# Altium project MCU021_V1.0.PrjPcb (part 3 of 3)

## Sheet MCU021_V1.0_Target_Device.SchDoc: Lauchpad Target Device, Buttons and LEDs
size A3; Date: Not shown in title block; ApprovedBy: Not shown in title block; CheckedBy: Not shown in title block; Author: Not shown in title block; CompanyName: Not shown in title block; Engineer: Not shown in title block; Organization: Not shown in title block; Address1: Not shown in title block; Address2: Not shown in title block; Address3: Not shown in title block; Address4: Not shown in title block; DocumentNumber: 4; Revision: Use project parameter SCH_Rev; SheetNumber: 4; SheetTotal: 5; PageSetup: Record=PageOptions|CenterHorizontal=True|CenterVertical=True|PrintScale=0.69|XCorrection=1.00|YCorrection=1.00|PrintKind=0|BorderSize=5000000|LeftOffset=0|BottomOffset=0|Orientation=2|PaperLength=1000|PaperWidth=1000|Scale=100|PaperSource=15|PrintQuality=600|MediaType=1|DitherType=10|PaperKind=Letter|PrintScaleMode=1; CurrentTime: Not shown in title block; CurrentDate: Not shown in title block; Time: Not shown in title block; DocumentFullPathAndName: Not shown in title block; DocumentName: Not shown in title block; ModifiedDate: Not shown in title block; ImagePath: Not shown in title block
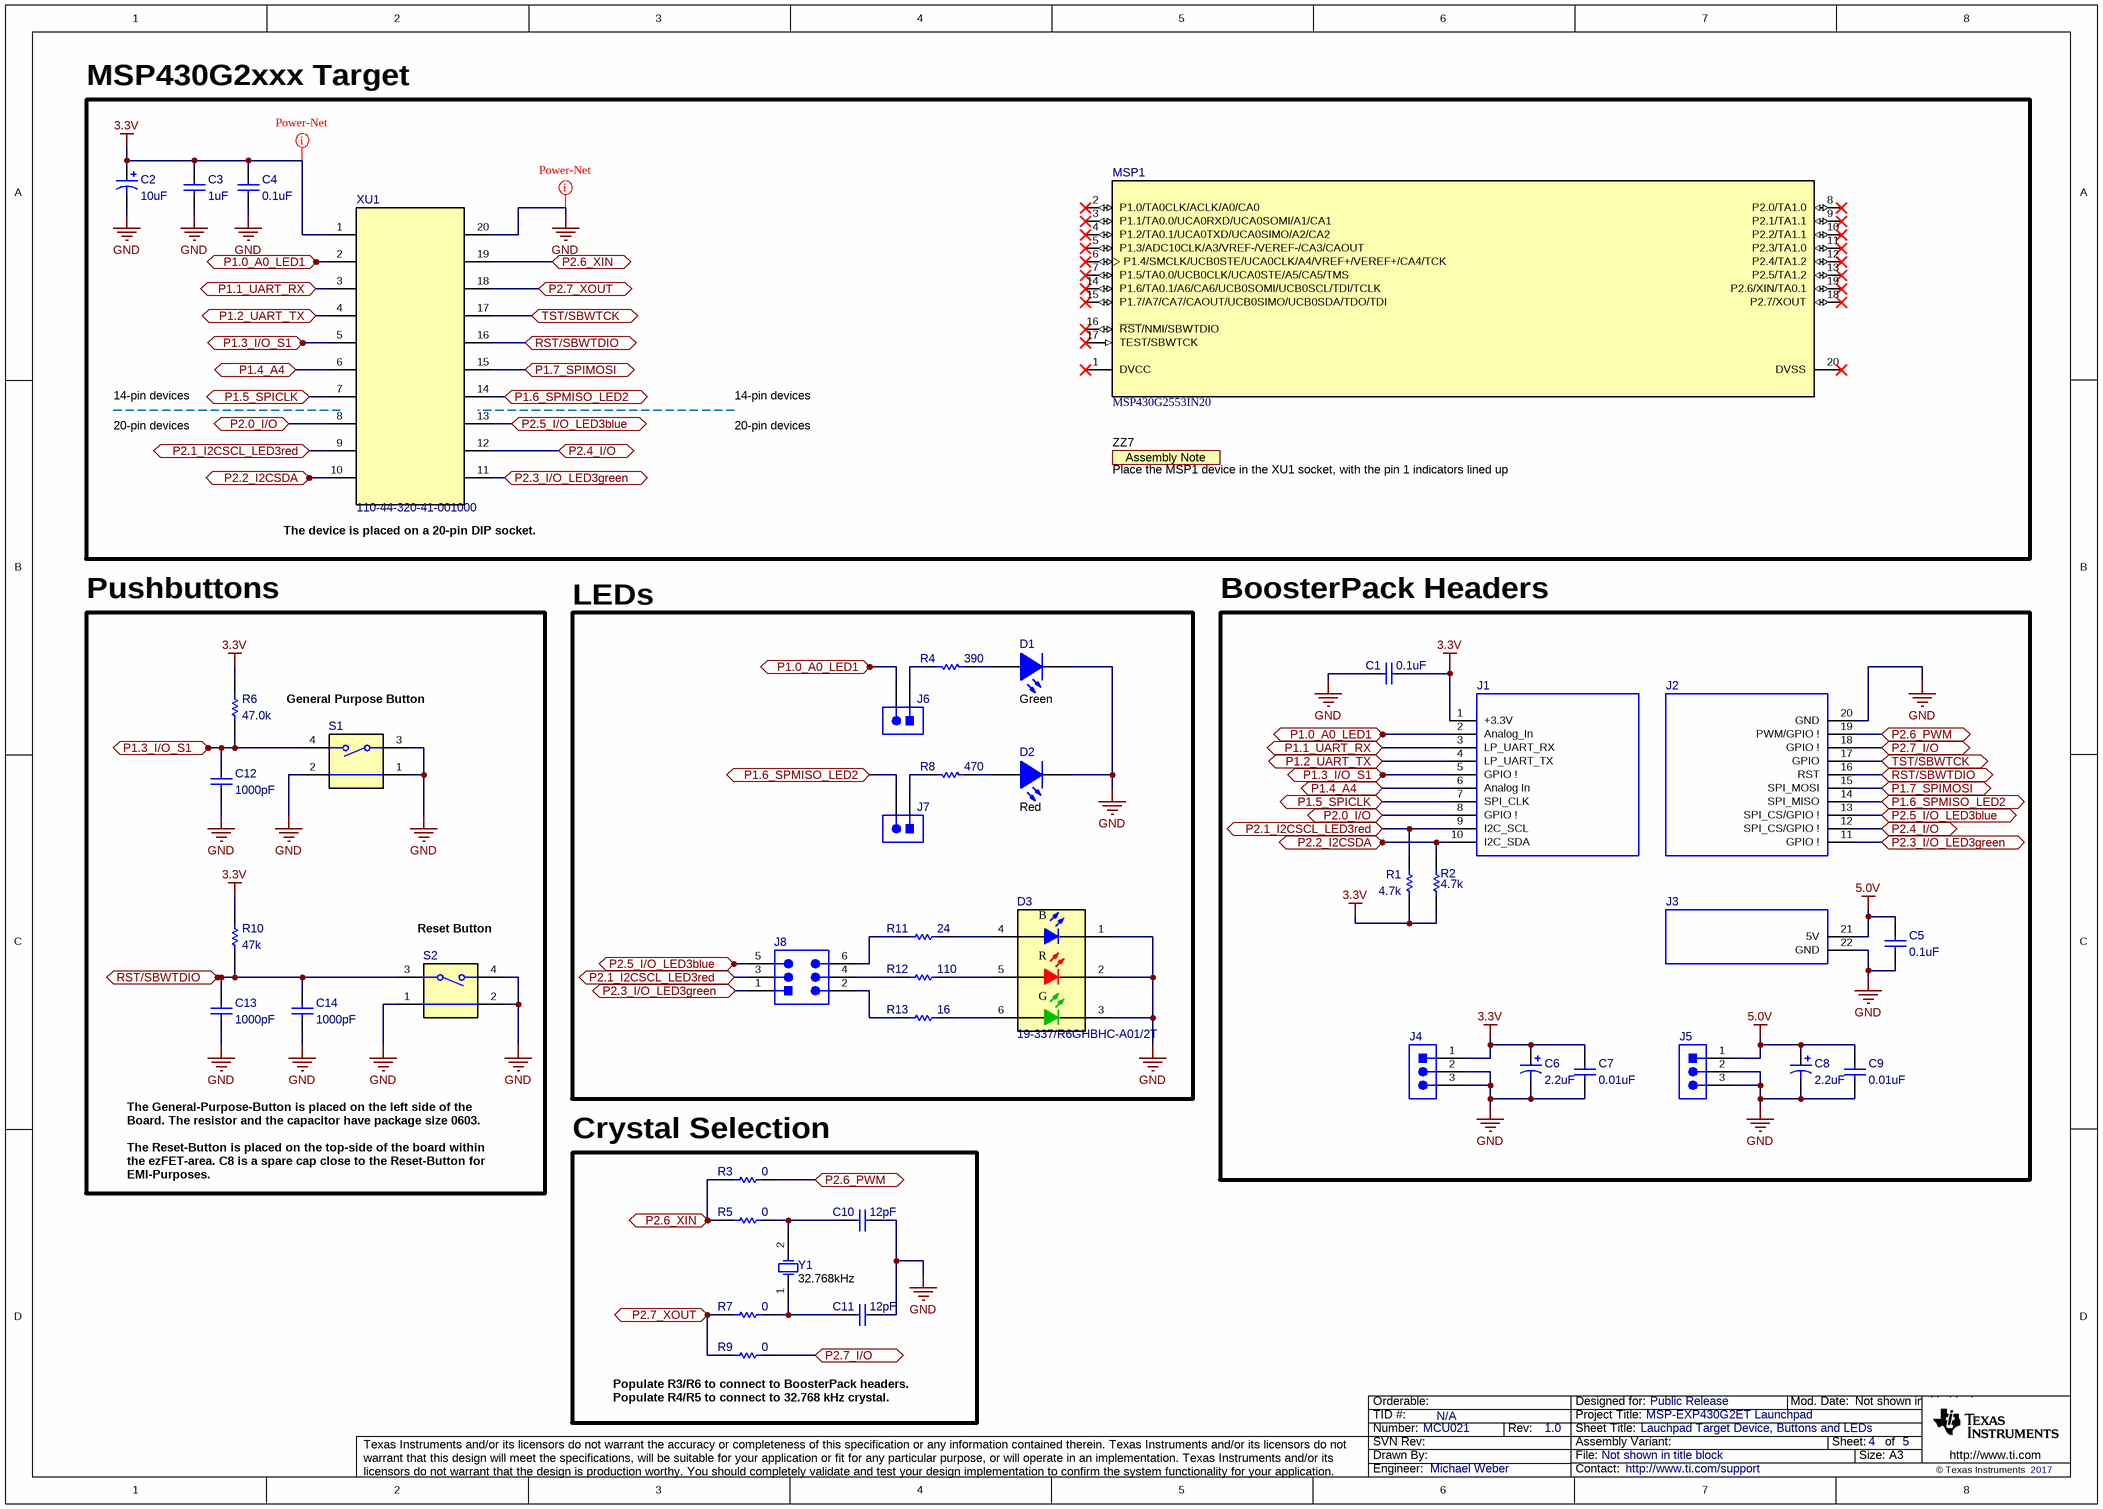
[diagram p3: MCU021_V1.0_Target_Device.SchDoc]

### Parts
C1  0.1uF  [0402]
C2  10uF  [3216-18]
C3  1uF  [0402]
C4  0.1uF  [0402]
C5  0.1uF  [0402]
C6  2.2uF  [3216-18]
C7  0.01uF  [0402]
C8  2.2uF  [3216-18]
C9  0.01uF  [0402]
C10  12pF  [0402]
C11  12pF  [0402]
C12  1000pF  [0603]
C13  1000pF  [0402]
C14  1000pF  [0402]
D1  value Green  [WL-SMCW_GREEN]  (hidden comment: 150060VS75000)
D2  value Red  [WL-SMCW_RED]  (hidden comment: 150060RS75000)
D3  19-337/R6GHBHC-A01/2T  [19-337_RGB]
J1  SSQ-110-03-F-S  [BoosterPack_20pin_J1]  (value not drawn)
J2  SSQ-110-03-F-S  [BoosterPack_20pin_J2]  (value not drawn)
J3  SSQ-102-03-F-S  [BoosterPack_20pin_J3]  (value not drawn)
J4  PEC03SAAN  [PEC03SAAN_Launchpad_3V3]  (value not drawn)
J5  PEC03SAAN  [PEC03SAAN_Launchpad_5V0]  (value not drawn)
J6  TSW-102-07-G-S  [TSW-102-07-G-S]  (value not drawn)
J7  TSW-102-07-G-S  [TSW-102-07-G-S]  (value not drawn)
J8  TSW-103-07-G-D  [TSW-103-07-G-D]  (value not drawn)
MSP1  MSP430G2553IN20  [N0020A]  (mechanical)
R1  4.7k  [0402]
R2  4.7k  [0402]
R3  0  [0603]
R4  390  [0402]
R5  0  [0603]
R6  47.0k  [0603]
R7  0  [0603]
R8  470  [0402]
R9  0  [0603]
R10  47k  [0402]
R11  24  [0402]
R12  110  [0402]
R13  16  [0402]
S1  1188E-1K2-V-TR  [SW_1188E]  (value not drawn)
S2  1188E-1K2-V-TR  [SW_1188E]  (value not drawn)
XU1  110-44-320-41-001000  [Mill-Max_110-xx-320-41-001000]
Y1  Frequency_Fixed: 32.768kHz  [ECS_ECX_31B]  (hidden comment: ECS-.327-12.5-34B-TR)
ZZ7  Place the MSP1 device in the XU1 socket, with the pin 1 indicators lined up  [AssemblyNote]  (no BOM)

### Blocks framed on the sheet
MSP430G2xxx Target: C2-C4 MSP1 XU1 ZZ7
Pushbuttons: C12-C14 R6 R10 S1 S2
LEDs: D1-D3 J6-J8 R4 R8 R11-R13
BoosterPack Headers: C1 C5-C9 J1-J5 R1 R2
Crystal Selection: C10 C11 R3 R5 R7 R9 Y1

### Ports
P1.0_A0_LED1 (bidir), P1.1_UART_RX (bidir), P1.2_UART_TX (bidir), P1.3_I/O_S1 (bidir), P1.4_A4 (bidir), P1.5_SPICLK (bidir), P1.6_SPMISO_LED2 (bidir), P1.7_SPIMOSI (bidir), P2.0_I/O (bidir), P2.1_I2CSCL_LED3red (bidir), P2.2_I2CSDA (bidir), P2.3_I/O_LED3green (bidir), P2.4_I/O (bidir), P2.5_I/O_LED3blue (bidir), P2.6_PWM (bidir), P2.6_XIN (bidir), P2.7_I/O (bidir), P2.7_XOUT (bidir), RST/SBWTDIO (bidir), TST/SBWTCK (bidir)

### Nets
3.3V: C1.1 C2.1(+) C3.1 C4.1 C6.1(+) C7.1 J1.1(+3.3V) J4.1 R1.1 R2.1 R6.2 R10.2 XU1.1
5.0V: C5.1 C8.1(+) C9.1 J3.21(5V) J5.1
GND: C1.2 C2.2(-) C3.2 C4.2 C5.2 C6.2(-) C7.2 C8.2(-) C9.2 C10.2 C11.2 C12.2 C13.2 C14.2 D1.1(K) D2.1(K) D3.1(K) D3.2(K) D3.3(K) J2.20(GND) J3.22(GND) J4.2 J4.3 J5.2 J5.3 S1.1 S1.2 S1.3 S2.1 S2.2 S2.4 XU1.20
P1.0_A0_LED1: J1.2(Analog_In) J6.2 XU1.2 ; port P1.0_A0_LED1
P1.1_UART_RX: J1.3(LP_UART_RX) XU1.3 ; port P1.1_UART_RX
P1.2_UART_TX: J1.4(LP_UART_TX) XU1.4 ; port P1.2_UART_TX
P1.3_I/O_S1: C12.1 J1.5(GPIO_!) R6.1 S1.4 XU1.5 ; port P1.3_I/O_S1
P1.4_A4: J1.6(Analog_In) XU1.6 ; port P1.4_A4
P1.5_SPICLK: J1.7(SPI_CLK) XU1.7 ; port P1.5_SPICLK
P1.6_SPMISO_LED2: J2.14(SPI_MISO) J7.2 XU1.14 ; port P1.6_SPMISO_LED2
P1.7_SPIMOSI: J2.15(SPI_MOSI) XU1.15 ; port P1.7_SPIMOSI
P2.0_I/O: J1.8(GPIO_!) XU1.8 ; port P2.0_I/O
P2.1_I2CSCL_LED3red: J1.9(I2C_SCL) J8.3 R1.2 XU1.9 ; port P2.1_I2CSCL_LED3red
P2.2_I2CSDA: J1.10(I2C_SDA) R2.2 XU1.10 ; port P2.2_I2CSDA
P2.3_I/O_LED3green: J2.11(GPIO_!) J8.1 XU1.11 ; port P2.3_I/O_LED3green
P2.4_I/O: J2.12(SPI_CS/GPIO_!) XU1.12 ; port P2.4_I/O
P2.5_I/O_LED3blue: J2.13(SPI_CS/GPIO_!) J8.5 XU1.13 ; port P2.5_I/O_LED3blue
P2.6_PWM: J2.19(PWM/GPIO_!) R3.2 ; port P2.6_PWM
P2.6_XIN: R3.1 R5.1 XU1.19 ; port P2.6_XIN
P2.7_I/O: J2.18(GPIO_!) R9.2 ; port P2.7_I/O
P2.7_XOUT: R7.1 R9.1 XU1.18 ; port P2.7_XOUT
RST/SBWTDIO: C13.1 C14.1 J2.16(RST) R10.1 S2.3 XU1.16 ; port RST/SBWTDIO
TST/SBWTCK: J2.17(GPIO) XU1.17 ; port TST/SBWTCK
NetC10_1: C10.1 R5.2 Y1.2(OSC2)
NetC11_1: C11.1 R7.2 Y1.1(OSC1)
NetD1_2: D1.2(A) R4.1
NetD2_2: D2.2(A) R8.2
NetD3_4: D3.4(A) R11.2
NetD3_5: D3.5(A) R12.2
NetD3_6: D3.6(A) R13.2
NetJ6_1: J6.1 R4.2
NetJ7_1: J7.1 R8.1
NetJ8_2: J8.2 R13.1
NetJ8_4: J8.4 R12.1
NetJ8_6: J8.6 R11.1

Not connected (* = marked no-connect by the designer): MSP1 1(DVCC)* 2(P1.0/TA0CLK/ACLK/A0/CA0)* 3(P1.1/TA0.0/UCA0RXD/UCA0SOMI/A1/CA1)* 4(P1.2/TA0.1/UCA0TXD/UCA0SIMO/A2/CA2)* 5(P1.3/ADC10CLK/A3/VREF-/VEREF-/CA3/CAOUT)* 6(P1.4/SMCLK/UCB0STE/UCA0CLK/A4/VREF+/VEREF+/CA4/TCK)* 7(P1.5/TA0.0/UCB0CLK/UCA0STE/A5/CA5/TMS)* 8(P2.0/TA1.0)* 9(P2.1/TA1.1)* 10(P2.2/TA1.1)* 11(P2.3/TA1.0)* 12(P2.4/TA1.2)* 13(P2.5/TA1.2)* 14(P1.6/TA0.1/A6/CA6/UCB0SOMI/UCB0SCL/TDI/TCLK)* 15(P1.7/A7/CA7/CAOUT/UCB0SIMO/UCB0SDA/TDO/TDI)* 16(~{RST}/NMI/SBWTDIO)* 17(TEST/SBWTCK)* 18(P2.7/XOUT)* 19(P2.6/XIN/TA0.1)* 20(DVSS)*

### Layout directives
net class Power-Net: 3.3V, GND

### Notes on the sheet
- 14-pin devices
- 20-pin devices
- (near XU1) The device is placed on a 20-pin DIP socket.
- General Purpose Button
- (near S2) Reset Button
- The General-Purpose-Button is placed on the left side of the Board. The resistor and the capacitor have package size 0603.
  The Reset-Button is placed on the top-side of the board within the ezFET-area. C8 is a spare cap close to the Reset-Button for EMI-Purposes.
- (near R9) Populate R3/R6 to connect to BoosterPack headers.
  Populate R4/R5 to connect to 32.768 kHz crystal.
- Drawn By:
- SVN Rev:
- Number:
- TID #:
- Orderable:
- Rev:
- Sheet Title:
- File:
- Project Title:
- Designed for:
- Assembly Variant:
- Mod. Date:
- Sheet:
- Size:
- of
- A3
- http://www.ti.com
- Texas Instruments and/or its licensors do not warrant the accuracy or completeness of this specification or any information contained therein. Texas Instruments and/or its licensors do not warrant that this design will meet the specifications, will be suitable for your application or fit for any particular purpose, or will operate in an implementation. Texas Instruments and/or its licensors do not warrant that the design is production worthy. You should completely validate and test your design implementation to confirm the system functionality for your application.
- Engineer:
- Contact:
- © Texas Instruments
- (in symbol 19-337/R6GHBHC-A01/2T) B; R; G
- (in symbol AssemblyNote) Assembly Note

### Library data of the parts
C1 C4 C5 = C1005X5R1A104K050BA: CAP, CERM, 0.1 µF, 10 V,+/- 10%, X5R, 0402; Manufacturer: TDK; Polarized: N; CompType: Capacitor; ValueDisplayed: 0.1µF; U/M: EA; Cap_F: 0.0000001; Tolerance_%: 10; Value1: Unknown; Value2: 10V; TaMin_C: -55; TaMax_C: 85; SizeArea_mm2: 0.5; SizeAreaWB_mm2: 3; SizeX_mm: 1; SizeZ_mm: 0.6; AEC Category: Q200; Green_Lifecycle: NRND; Green_REACh: Passed; SymbolVersion: 2008-07-09; Value: 0.1uF; PartNumber: C1005X5R1A104K050BA; PackageReference: 0402; RoHS: Y; VDC_V: 10; MountType: SMT; Technology: Ceramic; TempCo: X5R; Cap_Case: 0402; SizeY_mm: 0.5; Published: 2008-06-19; Publisher: Texas Instruments; LatestRevisionDate: 2017-05-28; ComponentLink1Description: Datasheet link; ComponentLink1URL: http://product.tdk.com/en/catalog/datasheets/mlcc_commercial_general_en.pdf; Supplier 1: Digi-Key; Supplier Part Number 1: 445-1265-1-ND; Supplier 2: Newark; Supplier Part Number 2: 90R7585; Supplier 3: Mouser; Supplier Part Number 3: 810-C1005X5R1A104K; AEC Qualified: ?; Green_EU RoHS: Passed; Green_EU RoHS-2: Passed
C2 = 293D106X0010A2TE3: CAP, TA, 10 µF, 10 V, +/- 20%, 3.4 ohm, SMD; Manufacturer: Vishay-Sprague; Polarized: Y; CompType: Capacitor; ValueDisplayed: 10µF; U/M: EA; Cap_F: 0.00001; Tolerance_%: 20; Value1: 3.4 ohm; VDC_V: 10; Value2: 10V; ESR_ohm: 3.4; IRMS_A: 0.15; TaMin_C: -55; TaMax_C: 125; Cap_Case: A; SizeAreaWB_mm2: 10.92; SizeArea_mm2: 5.12; SizeX_mm: 3.2; SizeY_mm: 1.6; SizeZ_mm: 1.8; AEC Category: Q200; SymbolVersion: 2008-07-09; Value: 10uF; PartNumber: 293D106X0010A2TE3; PackageReference: 3216-18; RoHS: Y; MountType: SMT; Technology: TA; Series: 293D; Publisher: Texas Instruments; LatestRevisionDate: 2017-03-13; LatestRevisionNote: Updated supplier links; ComponentLink1Description: Datasheet link; ComponentLink1URL: http://www.vishay.com/docs/40002/293d.pdf; Supplier 1: Digi-Key; Supplier Part Number 1: 718-1118-1-ND; Supplier 2: Newark; Supplier Part Number 2: 09K5784; Supplier 3: Mouser; Supplier Part Number 3: 74-293D106X0010A2TE3; AEC Qualified: ?
C3 = GRM155R61A105KE15D: CAP, CERM, 1 µF, 10 V,+/- 10%, X5R, 0402; Manufacturer: MuRata; Polarized: N; CompType: Capacitor; ValueDisplayed: 1µF; U/M: EA; Cap_F: 0.000001; Tolerance_%: 10; Value1: Unknown; Value2: 10V; TaMin_C: -55; TaMax_C: 85; SizeArea_mm2: 0.5; SizeAreaWB_mm2: 3; SizeX_mm: 1; SizeZ_mm: 0.6; AEC Category: Q200; Green_Lifecycle: Active; Green_REACh: Passed; SymbolVersion: 2008-07-09; Value: 1uF; PartNumber: GRM155R61A105KE15D; PackageReference: 0402; RoHS: Y; VDC_V: 10; MountType: SMT; Technology: Ceramic; TempCo: X5R; Cap_Case: 0402; SizeY_mm: 0.5; Published: 2008-06-19; Publisher: Texas Instruments; LatestRevisionDate: 2017-05-28; ComponentLink1Description: Datasheet link; ComponentLink1URL: http://search.murata.co.jp/Ceramy/PnsearchViewAction.do?HnOFG=ON&HnNFG=ON&SEL_CNT=50&sLang=en&sKey=GRM155R61A105KE15D&x=9&y=9&search=startwith; Supplier 1: Digi-Key; Supplier Part Number 1: 490-3890-1-ND; Supplier 2: Mouser; Supplier Part Number 2: 81-GRM155R61A105KE15; Supplier 3: Farnell; Supplier Part Number 3: 1735523; AEC Qualified: ?; Green_EU RoHS: Passed; Green_EU RoHS-2: Incomplete
C6 C8 = 293D225X9025A2TE3: CAP, TA, 2.2 µF, 25 V, +/- 10%, 6.3 ohm, SMD; Manufacturer: Vishay-Sprague; Polarized: Y; CompType: Capacitor; ValueDisplayed: 2.2µF; U/M: EA; Cap_F: 0.0000022; Tolerance_%: 10; Value1: 6.3 ohm; VDC_V: 25; Value2: 25V; ESR_ohm: 6.3; IRMS_A: 0.11; TaMin_C: -55; TaMax_C: 125; Cap_Case: A; SizeAreaWB_mm2: 10.92; SizeArea_mm2: 5.12; SizeX_mm: 3.2; SizeY_mm: 1.6; SizeZ_mm: 1.8; AEC Category: Q200; SymbolVersion: 2008-07-09; Value: 2.2uF; PartNumber: 293D225X9025A2TE3; PackageReference: 3216-18; RoHS: Y; MountType: SMT; Technology: TA; Series: 293D; Publisher: Texas Instruments; LatestRevisionDate: 2017-03-13; LatestRevisionNote: Updated supplier links; ComponentLink1Description: Datasheet link; ComponentLink1URL: http://www.vishay.com/docs/40002/293d.pdf; Supplier 1: Digi-Key; Supplier Part Number 1: 718-1134-1-ND; Supplier 2: Newark; Supplier Part Number 2: 09K6176; Supplier 3: Mouser; Supplier Part Number 3: 74-293D225X9025A2TE3; AEC Qualified: ?
C7 C9 = GRM155R71C103KA01D: CAP, CERM, 0.01 µF, 16 V,+/- 10%, X7R, 0402; Manufacturer: MuRata; Polarized: N; CompType: Capacitor; ValueDisplayed: 0.01µF; U/M: EA; Cap_F: 0.00000001; Tolerance_%: 10; Value1: Unknown; VDC_V: 16; Value2: 16V; TaMin_C: -55; TaMax_C: 125; SizeArea_mm2: 0.5; SizeAreaWB_mm2: 3; SizeX_mm: 1; SizeZ_mm: 0.6; AEC Category: Q200; Green_Lifecycle: Active; Green_REACh: Passed; SymbolVersion: 2008-07-09; Value: 0.01uF; PartNumber: GRM155R71C103KA01D; PackageReference: 0402; RoHS: Y; MountType: SMT; Technology: Ceramic; TempCo: X7R; Cap_Case: 0402; SizeY_mm: 0.5; Published: 2008-06-19; Publisher: Texas Instruments; LatestRevisionDate: 2017-05-28; ComponentLink1Description: Datasheet link; ComponentLink1URL: http://search.murata.co.jp/Ceramy/PnsearchViewAction.do?HnOFG=ON&HnNFG=ON&SEL_CNT=50&sLang=en&sKey=GRM155R71C103KA01D&x=9&y=9&search=startwith; Supplier 1: Digi-Key; Supplier Part Number 1: 490-1313-1-ND; Supplier 2: Newark; Supplier Part Number 2: 14T3279; Supplier 3: Mouser; Supplier Part Number 3: 81-GRM36X103K16; AEC Qualified: ?; Green_EU RoHS: Passed; Green_EU RoHS-2: Incomplete
C10 C11 = GRM1555C1H120JA01D: CAP, CERM, 12 pF, 50 V,+/- 5%, C0G/NP0, 0402; Manufacturer: MuRata; Polarized: N; CompType: Capacitor; U/M: EA; Cap_F: 0.000000000012; Tolerance_%: 5; Value1: Unknown; VDC_V: 50; Value2: 50V; TaMin_C: -55; TaMax_C: 125; SizeArea_mm2: 0.5; SizeAreaWB_mm2: 3; SizeX_mm: 1; SizeZ_mm: 0.6; AEC Category: Q200; Green_Lifecycle: Active; Green_REACh: Passed; SymbolVersion: 2008-07-09; Value: 12pF; PartNumber: GRM1555C1H120JA01D; ValueDisplayed: 12pF; PackageReference: 0402; RoHS: Y; MountType: SMT; Technology: Ceramic; TempCo: C0G/NP0; Cap_Case: 0402; SizeY_mm: 0.5; Published: 2008-06-19; Publisher: Texas Instruments; LatestRevisionDate: 2017-06-01; ComponentLink1Description: Datasheet link; ComponentLink1URL: http://search.murata.co.jp/Ceramy/PnsearchViewAction.do?HnOFG=ON&HnNFG=ON&SEL_CNT=50&sLang=en&sKey=GRM1555C1H120JA01D&x=9&y=9&search=startwith; Supplier 1: Newark; Supplier Part Number 1: 14T3292; Supplier 2: Mouser; Supplier Part Number 2: 81-GRM1555C1H120JA1D; Supplier 3: Farnell; Supplier Part Number 3: 1828875; AEC Qualified: ?; Green_EU RoHS: Passed; Green_EU RoHS-2: Incomplete
C12 = GRM188R71H102JA01D: CAP, CERM, 1000 pF, 50 V,+/- 5%, X7R, 0603; Manufacturer: MuRata; Polarized: N; CompType: Capacitor; U/M: EA; Cap_F: 0.000000001; Tolerance_%: 5; Value1: Unknown; VDC_V: 50; Value2: 50V; TaMin_C: -55; TaMax_C: 125; SizeArea_mm2: 1.28; SizeAreaWB_mm2: 4.68; SizeX_mm: 1.6; SizeY_mm: 0.8; SizeZ_mm: 1; AEC Category: Q200; SymbolVersion: 2008-07-09; Value: 1000pF; PartNumber: GRM188R71H102JA01D; ValueDisplayed: 1000pF; PackageReference: 0603; RoHS: Y; MountType: SMT; Technology: Ceramic; TempCo: X7R; Cap_Case: 0603; Published: 2008-06-19; Publisher: Texas Instruments; LatestRevisionDate: 2017-06-01; ComponentLink1Description: Datasheet link; ComponentLink1URL: http://psearch.murata.com/capacitor/product/GRM188R71H102JA01%23.pdf; Supplier 1: Digi-Key; Supplier Part Number 1: 490-9733-1-ND; Supplier 2: Mouser; Supplier Part Number 2: 81-GRM39X102J50D; AEC Qualified: N; AEC Grade: N/A
C13 C14 = GRM155R71H102KA01D: CAP, CERM, 1000 pF, 50 V,+/- 10%, X7R, 0402; Manufacturer: MuRata; Polarized: N; CompType: Capacitor; U/M: EA; Cap_F: 0.000000001; Tolerance_%: 10; Value1: Unknown; VDC_V: 50; Value2: 50V; TaMin_C: -55; TaMax_C: 125; SizeArea_mm2: 0.5; SizeAreaWB_mm2: 3; SizeX_mm: 1; SizeZ_mm: 0.6; AEC Category: Q200; Green_Lifecycle: Active; Green_REACh: Passed; SymbolVersion: 2008-07-09; Value: 1000pF; PartNumber: GRM155R71H102KA01D; ValueDisplayed: 1000pF; PackageReference: 0402; RoHS: Y; MountType: SMT; Technology: Ceramic; TempCo: X7R; Cap_Case: 0402; SizeY_mm: 0.5; Published: 2008-06-19; Publisher: Texas Instruments; LatestRevisionDate: 2017-05-28; ComponentLink1Description: Datasheet link; ComponentLink1URL: http://search.murata.co.jp/Ceramy/PnsearchViewAction.do?HnOFG=ON&HnNFG=ON&SEL_CNT=50&sLang=en&sKey=GRM155R71H102KA01D&x=9&y=9&search=startwith; Supplier 1: Digi-Key; Supplier Part Number 1: 490-1303-1-ND; Supplier 2: Newark; Supplier Part Number 2: 14T3283; Supplier 3: Mouser; Supplier Part Number 3: 81-GRM36X102K50; AEC Qualified: ?; Green_EU RoHS: Passed; Green_EU RoHS-2: Incomplete
D1 = 150060VS75000: LED, Green, SMD; Manufacturer: Wurth Elektronik; Type: AlInGaP; Vf_V: 2; Value2: 2V; Io_A: 0.02; Value1: W; U/M: EA; Green_Lifecycle: Active; Green_REACh: Passed; CompType: LED; PartNumber: 150060VS75000; SymbolVersion: 2008-11-06; MountType: SMT; RoHS: Y; PackageReference: LED_0603; Color: green; Published: 2008-07-11; Publisher: Texas Instruments; ComponentLink1URL: http://katalog.we-online.de/led/datasheet/150060VS75000.pdf; ComponentLink1Description: Datasheet link; LatestRevisionDate: 2017-05-19; Supplier 1: Digi-Key; Supplier Part Number 1: 732-4980-1-ND; Supplier 2: Newark; Supplier Part Number 2: 95W3797; Supplier 3: Farnell; Supplier Part Number 3: 2322073; Green_EU RoHS: Passed; Green_EU RoHS-2: Incomplete
D2 = 150060RS75000: LED, Red, SMD; Manufacturer: Wurth Elektronik; Type: AlInGaP; Vf_V: 2; Value2: 2V; Io_A: 0.03; Vr_V: 5; Tjmax_C: 85; Power_TotalModule: 0.072; Value1: 0.072W; Angle: 140; U/M: EA; Green_Lifecycle: Active; Green_REACh: Passed; CompType: LED; PartNumber: 150060RS75000; SymbolVersion: 2008-11-06; MountType: SMT; RoHS: Y; PackageReference: LED_0603; Color: Red; Published: 2008-07-11; Publisher: Texas Instruments; ComponentLink1URL: http://katalog.we-online.de/led/datasheet/150060RS75000.pdf; ComponentLink1Description: Datasheet link; LatestRevisionDate: 2017-05-19; Supplier 1: Digi-Key; Supplier Part Number 1: 732-4978-1-ND; Supplier 2: Newark; Supplier Part Number 2: 95W3795; Supplier 3: Mouser; Supplier Part Number 3: 710-150060RS75000; Green_EU RoHS: Passed; Green_EU RoHS-2: Incomplete
D3 = 19-337/R6GHBHC-A01/2T: LED, RGB, SMD; Manufacturer: Everlight; SymbolCreator: Altium; Vf_V: 3.8; Value2: 3.8V; Io_A: 0.025; Vr_V: 5; Ir_A: 5e-005; Tjmax_C: 85; Value1: W; Angle: 120; U/M: EA; SymbolVersion: 2017-06-23; PartNumber: 19-337/R6GHBHC-A01/2T; Value: Rgb; PackageReference: 1.6x1.6mm; RoHS: Y; CompType: LED; Type: ?; MountType: SMT; Color: RGB; Published: 2008-07-11; Publisher: Texas Instruments; ComponentLink1URL: http://www.everlight.com/file/ProductFile/19-337-R6GHBHC-A01-2T.pdf; ComponentLink1Description: Datasheet link; LatestRevisionDate: 2017-06-23; Supplier 1: Digi-Key; Supplier Part Number 1: 19-337/R6GHBHC-A01/2T-ND; Supplier 2: Mouser; Supplier Part Number 2: 638-19337R6GHBHCA01T
J1 = BoosterPack_20pin_J1: Receptacle, 2.54mm, 10x1, Gold, TH; Manufacturer: Samtec; Alternate Manufacturer: Major League Electronics; Alternate PartNumber: SSHQ-110-S-08-G-LF; SymbolCreator: a0412235; Note: Booster Pack 20 pin J1; SymbolVersion: 2015-10-21; CompType: Receptacle; PartNumber: SSQ-110-03-F-S; RoHS: Y; PackageReference: 10x1 Receptacle; MountType: TH; ComponentLink1Description: Datasheet Link; Publisher: Texas Instruments; LatestRevisionDate: 2017-05-23; Supplier 1: Farnell; Supplier Part Number 1: 2283783
J2 = BoosterPack_20pin_J2: Receptacle, 2.54mm, 10x1, Gold, TH; Manufacturer: Samtec; Alternate Manufacturer: Major League Electronics; Alternate PartNumber: SSHQ-110-S-08-G-LF; SymbolCreator: a0412235; Note: Booster Pack 20 pin J2; SymbolVersion: 2015-10-21; CompType: Receptacle; PartNumber: SSQ-110-03-F-S; RoHS: Y; PackageReference: 10x1 Receptacle; MountType: TH; ComponentLink1Description: Datasheet Link; Publisher: Texas Instruments; LatestRevisionDate: 2017-05-23; Supplier 1: Farnell; Supplier Part Number 1: 2283783
J3 = BoosterPack_20pin_J3: Receptacle, 2.54mm, 2x1, Gold, TH; Manufacturer: Samtec; SymbolCreator: a0412235; Note: Booster Pack 20 pin J3; SymbolVersion: 2015-10-21; CompType: Receptacle; PartNumber: SSQ-102-03-F-S; RoHS: Y; PackageReference: 2x1 Receptacle; MountType: TH; ComponentLink1Description: Datasheet Link; Publisher: Texas Instruments; LatestRevisionDate: 2017-05-23; Supplier 1: Farnell; Supplier Part Number 1: 2283777
J4 J5 = PEC03SAAN: Header, 100mil, 3x1, Tin, TH; Manufacturer: Sullins Connector Solutions; SymbolCreator: a0412235; Pitch_mm: 2.54; Gender: Male; Shrouded: N; Row_Count: 1; Current_A: 3; Voltage_V: 1800; Cert_UL: Y; Green_Lifecycle: Not Set; Green_REACh: Incomplete; SymbolVersion: 2017-03-03; PartNumber: PEC03SAAN; PackageReference: Header, 3 PIN, 100mil, Tin; ClassName: Header; CompType: Header; RoHS: Y; MountType: TH; ComponentLink1Description: Datasheet URL; ComponentLink1URL: http://www.sullinscorp.com/catalogs/77_PAGE108-109_.100_MALE_HDR.pdf; Orientation: Vertical; PinCount: 3; ContactFinish: Tin; Color: Black; Publisher: Texas Instruments; LatestRevisionDate: 2017-05-15; Supplier 1: Digi-Key; Supplier Part Number 1: S1012E-03-ND; Green_EU RoHS: Incomplete; Green_EU RoHS-2: Incomplete
J6 J7 = TSW-102-07-G-S: Header, 100mil, 2x1, Gold, TH; Manufacturer: Samtec; SymbolCreator: a0412235; Pitch_mm: 2.54; Gender: Male; Shrouded: N; Row_Count: 1; Current_A: 6.3; Voltage_V: 550; Cert_CSA: Y; SymbolVersion: 2013-10-31; PartNumber: TSW-102-07-G-S; PackageReference: 2x1 Header; ClassName: Header; CompType: Header; RoHS: Y; MountType: TH; ComponentLink1Description: Datasheet URL; ComponentLink1URL: http://samtec.com/ftppub/pdf/TSW_TH.PDF; Orientation: Vertical; PinCount: 2; ContactFinish: Gold; Color: Black; Cert_UL: Y; Cert_CULUS: N; Cert_VDE: N; Publisher: Texas Instruments; LatestRevisionDate: 2017-04-12; Supplier 1: Digi-Key; Supplier Part Number 1: SAM1029-02-ND
J8 = TSW-103-07-G-D: Header, 100mil, 3x2, Gold, TH; Manufacturer: Samtec; SymbolCreator: a0412235; Pitch_mm: 2.54; Gender: Male; Shrouded: N; Row_Count: 2; Current_A: 6.3; Voltage_V: 550; Cert_CSA: Y; SymbolVersion: 2013-10-14; PartNumber: TSW-103-07-G-D; PackageReference: 3x2 Header; ClassName: Header; CompType: Header; RoHS: Y; MountType: TH; ComponentLink1Description: Datasheet URL; ComponentLink1URL: http://samtec.com/ftppub/pdf/TSW_TH.PDF; Orientation: Vertical; PinCount: 6; RowSpacing_mm: 2.54; ContactFinish: Gold; Color: Black; Cert_UL: Y; Cert_CULUS: N; Cert_VDE: N; Publisher: Texas Instruments; LatestRevisionDate: 2017-04-12; Supplier 1: Digi-Key; Supplier Part Number 1: SAM1028-03-ND
MSP1 = CMP-0039636-1: 16 MHz Mixed Signal Microcontroller with 16 KB Flash, 512 B SRAM and 24 GPIOs, -40 to 85 degC, 20-pin DIP (N), Pb-Free (RoHS); Manufacturer: Texas Instruments; USCI_B (I2C & SPI): 1; Cap touch I/O: Yes; Timers - 16-bit: 2; GPIO: 24; ADC Channels: 8; SubFamily: Value Line; Frequency(MHz): 16; ADC: 10-bit SAR; SRAM(B): 512; ComponentLink3Description: Package Specification; Code_JEDEC: MS-001; ComponentLink1Description: Manufacturer URL; DatasheetVersion: SLAS735G; PartNumber: MSP430G2553IN20; ComponentLink2URL: http://www.ti.com/general/docs/lit/getliterature.tsp?genericPartNumber=MSP430G2553&fileType=pdf; ComponentLink2Description: Datasheet; Comparators: Yes; USCI_A (UART/LIN/IrDA/SPI): 1; Watchdog: Yes; PackageReference: N0020A; Eco-Plan: Pb-Free (RoHS); PackageVersion: 4040049/E; Temp Sensor: Yes; ComponentLink3URL: http://www.ti.com/litv/pdf/mpds177g; PackageDescription: 20-Pin Plastic In-Line, Body 25.40 x 6.35 mm, Pitch 2.54 mm; Brown Out Reset: Yes; Mounting Technology: Through Hole; ComponentLink1URL: http://www.ti.com/; Flash(KB): 16
R1 R2 = CRCW04024K70JNED: RES, 4.7 k, 5%, 0.063 W, 0402; Manufacturer: Vishay-Dale; CompType: Resistor; Res_ohm: 4700; Value_Code: 4k70; Tolerance_%: 5; Power_W: 0.063; Value2: 0.063W; VDC_V: 50; TempCo: 200 ppm/C; SizeArea_mm2: 0.5; SizeX_mm: 1; SizeZ_mm: 0.6; EIA_Code: E24; U/M: EA; AEC Category: Q200; SymbolVersion: 2009-05-29; Value: 4.7k; PartNumber: CRCW04024K70JNED; ValueDisplayed: 4.7k; PackageReference: 0402; RoHS: Y; Value1: 5%; MountType: SMT; Technology: Thick Film; SizeY_mm: 0.5; Published: 2008-06-26; Publisher: Texas Instruments; LatestRevisionDate: 2017-04-13; ComponentLink1Description: Datasheet link; ComponentLink1URL: http://www.vishay.com/docs/20035/dcrcwe3.pdf; Supplier 1: Digi-Key; Supplier Part Number 1: 541-4.7KJCT-ND; Supplier 2: Newark; Supplier Part Number 2: 59M6733; Supplier 3: Mouser; Supplier Part Number 3: 71-CRCW0402J-4.7K-E3; AEC Qualified: ?
R3 R5 R7 R9 = CRCW06030000Z0EA: RES, 0, 5%, 0.1 W, 0603; Manufacturer: Vishay-Dale; CompType: Resistor; Value_Code: 0000; Tolerance_%: 5; Power_W: 0.1; Value2: 0.1W; VDC_V: 75; TempCo: 200 ppm/C; SizeArea_mm2: 1.28; SizeX_mm: 1.6; SizeY_mm: 0.8; SizeZ_mm: 1; EIA_Code: E24; U/M: EA; AEC Category: Q200; Green_Lifecycle: Active; Green_REACh: Passed; SymbolVersion: 2009-05-29; Value: 0; PartNumber: CRCW06030000Z0EA; ValueDisplayed: 0; PackageReference: 0603; RoHS: Y; Res_ohm: 0; Value1: 5%; MountType: SMT; Technology: Thick Film; Published: 2008-06-26; Publisher: Texas Instruments; LatestRevisionDate: 2017-05-31; ComponentLink1Description: Datasheet link; ComponentLink1URL: http://www.vishay.com/docs/20035/dcrcwe3.pdf; Supplier 1: Digi-Key; Supplier Part Number 1: 541-0.0GCT-ND; Supplier 2: Newark; Supplier Part Number 2: 52K8014; Supplier 3: Mouser; Supplier Part Number 3: 71-CRCW0603-0-E3; AEC Qualified: ?; Green_EU RoHS: Passed with Exemption; Green_EU RoHS-2: Passed
R4 = CRCW0402390RJNED: RES, 390, 5%, 0.063 W, 0402; Manufacturer: Vishay-Dale; CompType: Resistor; Value_Code: 390R; Tolerance_%: 5; Power_W: 0.063; Value2: 0.063W; VDC_V: 50; TempCo: 200 ppm/C; SizeArea_mm2: 0.5; SizeX_mm: 1; SizeZ_mm: 0.6; EIA_Code: E24; U/M: EA; AEC Category: Q200; SymbolVersion: 2009-05-29; Value: 390; PartNumber: CRCW0402390RJNED; ValueDisplayed: 390; PackageReference: 0402; RoHS: Y; Res_ohm: 390; Value1: 5%; MountType: SMT; Technology: Thick Film; SizeY_mm: 0.5; Published: 2008-06-26; Publisher: Texas Instruments; LatestRevisionDate: 2017-04-13; ComponentLink1Description: Datasheet link; ComponentLink1URL: http://www.vishay.com/docs/20035/dcrcwe3.pdf; Supplier 1: Digi-Key; Supplier Part Number 1: 541-390JCT-ND; Supplier 2: Newark; Supplier Part Number 2: 59M6731; Supplier 3: Mouser; Supplier Part Number 3: 71-CRCW0402J-390-E3; AEC Qualified: ?
R6 = CRCW060347K0FKEA: RES, 47.0 k, 1%, 0.1 W, AEC-Q200 Grade 0, 0603; Manufacturer: Vishay-Dale; CompType: Resistor; Res_ohm: 47000; Value_Code: 47k0; Tolerance_%: 1; Power_W: 0.1; Value2: 0.1W; VDC_V: 75; TempCo: 100 ppm/C; SizeArea_mm2: 1.28; SizeX_mm: 1.6; SizeY_mm: 0.8; U/M: EA; AEC Category: Q200; AEC Qualified: Y; AEC Grade: 0; SymbolVersion: 2009-05-29; Value: 47.0k; PartNumber: CRCW060347K0FKEA; ValueDisplayed: 47.0k; PackageReference: 0603; RoHS: Y; Value1: 1%; MountType: SMT; Technology: Thick Film; SizeZ_mm: 1; Published: 2008-06-26; Publisher: Texas Instruments; LatestRevisionDate: 2017-05-31; ComponentLink1Description: Datasheet link; ComponentLink1URL: http://www.vishay.com/docs/20035/dcrcwe3.pdf; Supplier 1: Digi-Key; Supplier Part Number 1: 541-47.0KHCT-ND; Supplier 2: Newark; Supplier Part Number 2: 61M5392; Supplier 3: Mouser; Supplier Part Number 3: 71-CRCW0603-47K-E3
R8 = CRCW0402470RJNED: RES, 470, 5%, 0.063 W, 0402; Manufacturer: Vishay-Dale; CompType: Resistor; Value_Code: 470R; Tolerance_%: 5; Power_W: 0.063; Value2: 0.063W; VDC_V: 50; TempCo: 200 ppm/C; SizeArea_mm2: 0.5; SizeX_mm: 1; SizeZ_mm: 0.6; EIA_Code: E24; U/M: EA; AEC Category: Q200; SymbolVersion: 2009-05-29; Value: 470; PartNumber: CRCW0402470RJNED; ValueDisplayed: 470; PackageReference: 0402; RoHS: Y; Res_ohm: 470; Value1: 5%; MountType: SMT; Technology: Thick Film; SizeY_mm: 0.5; Published: 2008-06-26; Publisher: Texas Instruments; LatestRevisionDate: 2017-04-13; ComponentLink1Description: Datasheet link; ComponentLink1URL: http://www.vishay.com/docs/20035/dcrcwe3.pdf; Supplier 1: Digi-Key; Supplier Part Number 1: 541-470JCT-ND; Supplier 2: Newark; Supplier Part Number 2: 59M6737; Supplier 3: Mouser; Supplier Part Number 3: 71-CRCW0402J-470-E3; AEC Qualified: ?
R10 = CRCW040247K0JNED: RES, 47 k, 5%, 0.063 W, 0402; Manufacturer: Vishay-Dale; CompType: Resistor; Res_ohm: 47000; Value_Code: 47k0; Tolerance_%: 5; Power_W: 0.063; Value2: 0.063W; VDC_V: 50; TempCo: 200 ppm/C; SizeArea_mm2: 0.5; SizeX_mm: 1; SizeZ_mm: 0.6; EIA_Code: E24; U/M: EA; AEC Category: Q200; SymbolVersion: 2009-05-29; Value: 47k; PartNumber: CRCW040247K0JNED; ValueDisplayed: 47k; PackageReference: 0402; RoHS: Y; Value1: 5%; MountType: SMT; Technology: Thick Film; SizeY_mm: 0.5; Published: 2008-06-26; Publisher: Texas Instruments; LatestRevisionDate: 2017-04-13; ComponentLink1Description: Datasheet link; ComponentLink1URL: http://www.vishay.com/docs/20035/dcrcwe3.pdf; Supplier 1: Digi-Key; Supplier Part Number 1: 541-47KJCT-ND; Supplier 2: Newark; Supplier Part Number 2: 52K7099; Supplier 3: Mouser; Supplier Part Number 3: 71-CRCW0402-J-47K-E3; AEC Qualified: ?
R11 = CRCW040224R0JNED: RES, 24, 5%, 0.063 W, 0402; Manufacturer: Vishay-Dale; CompType: Resistor; Value_Code: 24R0; Tolerance_%: 5; Power_W: 0.063; Value2: 0.063W; VDC_V: 50; TempCo: 200 ppm/C; SizeArea_mm2: 0.5; SizeX_mm: 1; SizeZ_mm: 0.6; EIA_Code: E24; U/M: EA; AEC Category: Q200; Green_Lifecycle: Active; Green_REACh: Passed; SymbolVersion: 2009-05-29; Value: 24; PartNumber: CRCW040224R0JNED; ValueDisplayed: 24; PackageReference: 0402; RoHS: Y; Res_ohm: 24; Value1: 5%; MountType: SMT; Technology: Thick Film; SizeY_mm: 0.5; Published: 2008-06-26; Publisher: Texas Instruments; LatestRevisionDate: 2017-06-12; ComponentLink1Description: Datasheet link; ComponentLink1URL: http://www.vishay.com/docs/20035/dcrcwe3.pdf; Supplier 1: Digi-Key; Supplier Part Number 1: 541-24JCT-ND; Supplier 2: Newark; Supplier Part Number 2: 89M6631; Supplier 3: Mouser; Supplier Part Number 3: 71-CRCW0402J-24-E3; AEC Qualified: ?; Green_EU RoHS: Passed with Exemption; Green_EU RoHS-2: Passed
R12 = CRCW0402110RFKED: RES, 110, 1%, 0.063 W, 0402; Manufacturer: Vishay-Dale; CompType: Resistor; Value_Code: 110R; Tolerance_%: 1; Power_W: 0.063; Value2: 0.063W; VDC_V: 50; TempCo: 100 ppm/C; SizeArea_mm2: 0.5; SizeZ_mm: 0.6; EIA_Code: E96; U/M: EA; AEC Category: Q200; Green_Lifecycle: Active; Green_REACh: Passed; SymbolVersion: 2009-05-29; Value: 110; PartNumber: CRCW0402110RFKED; ValueDisplayed: 110; PackageReference: 0402; RoHS: Y; Res_ohm: 110; Value1: 1%; MountType: SMT; Technology: Thick Film; SizeX_mm: 1; SizeY_mm: 0.5; Published: 2008-06-26; Publisher: Texas Instruments; LatestRevisionDate: 2017-06-12; ComponentLink1Description: Datasheet link; ComponentLink1URL: http://www.vishay.com/docs/20035/dcrcwe3.pdf; Supplier 1: Digi-Key; Supplier Part Number 1: 541-110LCT-ND; Supplier 2: Newark; Supplier Part Number 2: 52K6634; Supplier 3: Mouser; Supplier Part Number 3: 71-CRCW0402-110-E3; AEC Qualified: ?; Green_EU RoHS: Passed with Exemption; Green_EU RoHS-2: Passed
R13 = CRCW040216R0JNED: RES, 16, 5%, 0.063 W, 0402; Manufacturer: Vishay-Dale; CompType: Resistor; Value_Code: 16R0; Tolerance_%: 5; Power_W: 0.063; Value2: 0.063W; VDC_V: 50; TempCo: 200 ppm/C; SizeArea_mm2: 0.5; SizeX_mm: 1; SizeZ_mm: 0.6; EIA_Code: E24; U/M: EA; AEC Category: Q200; SymbolVersion: 2009-05-29; Value: 16; PartNumber: CRCW040216R0JNED; ValueDisplayed: 16; PackageReference: 0402; RoHS: Y; Res_ohm: 16; Value1: 5%; MountType: SMT; Technology: Thick Film; SizeY_mm: 0.5; Published: 2008-06-26; Publisher: Texas Instruments; LatestRevisionDate: 2017-06-12; ComponentLink1Description: Datasheet link; ComponentLink1URL: http://www.vishay.com/docs/20035/dcrcwe3.pdf; Supplier 1: Digi-Key; Supplier Part Number 1: 541-16JCT-ND; Supplier 2: Mouser; Supplier Part Number 2: 71-CRCW0402J-16-E3; AEC Qualified: ?
S1 S2 = 1188E-1K2-V-TR: Switch, SPST, 0.05 A, 12 VDC, SMD; Manufacturer: Diptronics; SymbolCreator: Altium; SizeAreaWB_mm2: 53.9; SizeArea_mm2: 27.3; SizeX_mm: 7.8; SizeY_mm: 3.5; VDC_V: 12; PositionCount: 1; CurrentRating_mA: 50; SymbolVersion: 2017-02-06; PartNumber: 1188E-1K2-V-TR; MountType: SMT; SizeZ_mm: 3.5; ComponentLink1Description: Datasheet URL; ComponentLink1URL: http://www.dip.com.tw/en/en-product-information/en-switch004/item/download/1976_b080c057386714e3a6604cbe658b9df3; RoHS: Y; Circuit: SPST; Orientation: Side Actuated; CompType: Switch; PackageReference: 7.8x3.5mm; Publisher: Texas Instruments; LatestRevisionDate: 2017-05-08
XU1 = 110-44-320-41-001000: Socket, DIP-20, Sleeve Pin, 2.54 mm Pitch; Manufacturer: Mill-Max; SymbolCreator: a0799628; U/M: EA; SymbolVersion: 2016-3-1; PartNumber: 110-44-320-41-001000; CompType: Socket; PackageReference: DIP-20, Body 25.3x10.1mm, Pitch 2.54mm; MountType: TH; RoHS: Y; ComponentLink1Description: Datasheet Link; ComponentLink1URL: http://www.mill-max.com/assets/pdfs/metric/090M.pdf; Publisher: Texas Instruments; LatestRevisionDate: 2017-05-30; Supplier 1: Digi-Key; Supplier Part Number 1: ED90052-ND; Supplier 2: Mouser; Supplier Part Number 2: 575-11044320; Supplier 3: Farnell; Supplier Part Number 3: 1228482
Y1 = CMP-0078856-1: Crystal, 32.768 KHz, 20 ppm, SMD; Manufacturer: ECS Inc.; SizeAreaWB_mm2: 10.5; SizeArea_mm2: 4.8; Frequency Tolerance: 20 ppm; AEC Category: Q200; TaMax_C: 85°C; SizeZ_mm: 0.9; TaMin_C: -40°C; SizeY_mm: 1.5; SizeX_mm: 3.2; ComponentLink1Description: Datasheet Link; REACh: Y; RoHS: Y; Supplier 1: Digi-Key; AEC Qualified: ?; PackageReference: 3.2x1.5mm; PartNumber: ECS-.327-12.5-34B-TR; Supplier Part Number 2: 520-327-12.5-34B; Supplier 2: Mouser; ComponentLink1URL: http://www.ecsxtal.com/store/pdf/ecx-31b.pdf; CompType: Crystal; Supplier Part Number 1: XC1617CT-ND; MountType: SMT
ZZ7 = AssemblyNote: SymbolCreator: codlsc; SymbolVersion: 2010-05-18; CompType: AssemblyNote; ClassName: AssemblyNote; Publisher: Texas Instruments; LatestRevisionDate: 2012-06-14; LatestRevisionNote: Initial Version; Alternate Manufacturer: -; Alternate PartNumber: -

## Sheet MCU021_V1.0_Hardware.SchDoc: Labels, Mechanical Hardware, Shunts, Misc.
size A3; Date: Not shown in title block; ApprovedBy: Not shown in title block; CheckedBy: Not shown in title block; Author: Not shown in title block; CompanyName: Not shown in title block; Engineer: Not shown in title block; Organization: Not shown in title block; Address1: Not shown in title block; Address2: Not shown in title block; Address3: Not shown in title block; Address4: Not shown in title block; DocumentNumber: 5; Revision: Use project parameter SCH_Rev; SheetNumber: 5; SheetTotal: 5; PageSetup: Record=PageOptions|CenterHorizontal=True|CenterVertical=True|PrintScale=1.00|XCorrection=1.00|YCorrection=1.00|PrintKind=0|BorderSize=5000000|LeftOffset=0|BottomOffset=0|Orientation=2|PaperLength=1000|PaperWidth=1000|Scale=100|PaperSource=15|PrintQuality=600|MediaType=1|DitherType=10|PaperKind=Letter|PrintScaleMode=1; CurrentTime: Not shown in title block; CurrentDate: Not shown in title block; Time: Not shown in title block; DocumentFullPathAndName: Not shown in title block; DocumentName: Not shown in title block; ModifiedDate: Not shown in title block; ImagePath: Not shown in title block
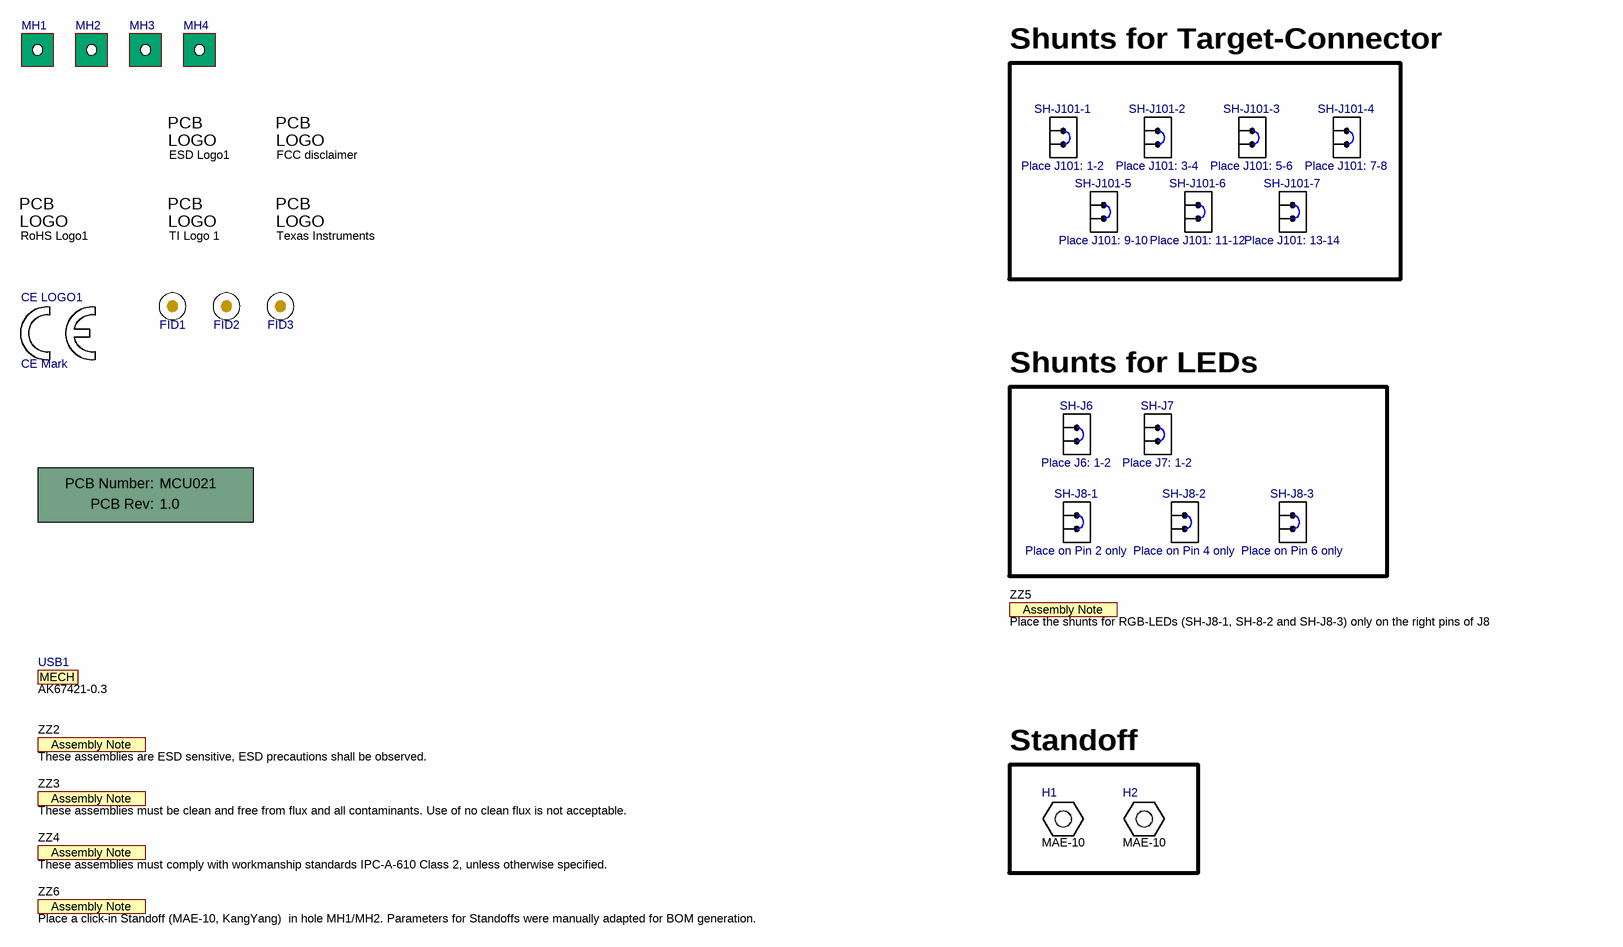
[diagram p4: MCU021_V1.0_Hardware.SchDoc]

### Parts
!PCB  Printed Circuit Board  (value not drawn)  (mechanical)
CE_LOGO1  CE Mark  [CE_Mark_5mm]  (no BOM)
ESD_Logo1  ESD Susceptible  [ESD_Overlay_Medium]  (value not drawn)  (no BOM)
FID1  Fiducial  [Fiducial6.4-20]  (value not drawn)
FID2  Fiducial  [Fiducial6.4-20]  (value not drawn)
FID3  Fiducial  [Fiducial6.4-20]  (value not drawn)
H1  MAE-10  [KY_MAE-10]
H2  MAE-10  [KY_MAE-10]
Logo1  Texas Instruments  [TI_Symbol_Overlay_Medium]  (no BOM)
Logo3  FCC disclaimer  [FCC_disclaimer]  (no BOM)
MH1  MTG_NoPads  [NPTH125mil]  (value not drawn)  (no BOM)
MH2  MTG_NoPads  [NPTH125mil]  (value not drawn)  (no BOM)
MH3  MTG_NoPads  [NPTH125mil]  (value not drawn)  (no BOM)
MH4  MTG_NoPads  [NPTH125mil]  (value not drawn)  (no BOM)
RoHS_Logo1  Pb-Free Symbol  [Pb-Free_Overlay_Medium]  (value not drawn)  (no BOM)
SH-J6  Place J6: 1-2  [SNT-100-BK-G]
SH-J7  Place J7: 1-2  [SNT-100-BK-G]
SH-J8-1  Place on Pin 2 only  [SNT-100-BK-G]
SH-J8-2  Place on Pin 4 only  [SNT-100-BK-G]
SH-J8-3  Place on Pin 6 only  [SNT-100-BK-G]
SH-J101-1  Place J101: 1-2  [SNT-100-BK-G]
SH-J101-2  Place J101: 3-4  [SNT-100-BK-G]
SH-J101-3  Place J101: 5-6  [SNT-100-BK-G]
SH-J101-4  Place J101: 7-8  [SNT-100-BK-G]
SH-J101-5  Place J101: 9-10  [SNT-100-BK-G]
SH-J101-6  Place J101: 11-12  [SNT-100-BK-G]
SH-J101-7  Place J101: 13-14  [SNT-100-BK-G]
TI_Logo_1  Texas Instruments  [TI_Horizontal_Overlay_Medium]  (value not drawn)  (no BOM)
USB1  AK67421-0.3  (mechanical)
ZZ2  These assemblies are ESD sensitive, ESD precautions shall be observed.  [AssemblyNote]  (no BOM)
ZZ3  These assemblies must be clean and free from flux and all contaminants. Use of no clean flux is not acceptable.  [AssemblyNote]  (no BOM)
ZZ4  These assemblies must comply with workmanship standards IPC-A-610 Class 2, unless otherwise specified.  [AssemblyNote]  (no BOM)
ZZ5  Place the shunts for RGB-LEDs (SH-J8-1, SH-8-2 and SH-J8-3) only on the right pins of J8  [AssemblyNote]  (no BOM)
ZZ6  Place a click-in Standoff (MAE-10, KangYang)  in hole MH1/MH2. Parameters for Standoffs were manually adapted for BOM generation.  [AssemblyNote]  (no BOM)

### Blocks framed on the sheet
Shunts for Target-Connector: SH-J101-1-SH-J101-7
Shunts for LEDs: SH-J6 SH-J7 SH-J8-1-SH-J8-3
Standoff: H1 H2

### Notes on the sheet
- Drawn By:
- SVN Rev:
- Number:
- TID #:
- Orderable:
- Rev:
- Sheet Title:
- File:
- Project Title:
- Designed for:
- Assembly Variant:
- Mod. Date:
- Sheet:
- Size:
- of
- A3
- http://www.ti.com
- Texas Instruments and/or its licensors do not warrant the accuracy or completeness of this specification or any information contained therein. Texas Instruments and/or its licensors do not warrant that this design will meet the specifications, will be suitable for your application or fit for any particular purpose, or will operate in an implementation. Texas Instruments and/or its licensors do not warrant that the design is production worthy. You should completely validate and test your design implementation to confirm the system functionality for your application.
- Engineer:
- Contact:
- © Texas Instruments
- (in symbol AssemblyNote) Assembly Note
- (in symbol CMP-0077983-1) MECH
- (in symbol ESD_Susceptible) PCB; LOGO
- (in symbol FCC_disclaimer) PCB; LOGO
- (in symbol Pb-Free) PCB; LOGO
- (in symbol PCB) PCB Number:; PCB Rev:
- (in symbol TI_Logo) PCB; LOGO

### Library data of the parts
!PCB = PCB: Manufacturer: Any; PartNumber: MCU021; SymbolCreator: a0412235; SymbolVersion: 2012-05-30; CompType: PCB; RoHS: O; MountType: N/A; Publisher: Texas Instruments; LatestRevisionDate: 2012-06-27; LatestRevisionNote: Initial Version; Alternate Manufacturer: -; Alternate PartNumber: -
CE_LOGO1 = CMP-0074844-1: SymbolCreator: a0412235; Publisher: Texas Instruments; Library Reference: CE Mark; Lib Reference: CE Mark; LatestRevisionDate: 2017-07-06; PartNumber: CE Mark; Published: 2009-03-03
ESD_Logo1 = ESD_Susceptible: ESD Susceptible Symbol; SymbolCreator: a0412235; SymbolVersion: 2011-08-22; Published: 2009-03-03; Publisher: Texas Instruments; LatestRevisionDate: 2016-03-21
FID1-FID3 = Fiducial: Fiducial mark.  There is nothing to buy or mount.; SymbolCreator: codlsc; SymbolVersion: 2009-11-4; CompType: Fiducial; PackageReference: N/A; ClassName: FiducialMark; Manufacturer: N/A; PartNumber: N/A; MountType: N/A; Publisher: Texas Instruments; LatestRevisionDate: 2017-05-31; LatestRevisionNote: Added Alternate PartNumber and Alternate Manufacturer parameters to appropriate components.
H1 H2 = CMP-0077978-1: Spacer Support, Nylon 66; Manufacturer: Kang Yang; CompType: Standoff; PartNumber: MAE-10; Key: MAE-10; PackageReference: Spacer Nylon Support; ComponentLink1Description: Datasheet Link; MountType: N/A; ComponentLink1URL: https://sps16.itg.ti.com/sites/KMS/crossdivteams/altium/docs/ComponentDatasheets/1104004000018---MAE-10.pdf; RoHS: Y
Logo1 = TI_Logo: Texas Instrument Corporate Signature; SymbolCreator: codlsc; SymbolVersion: 2011-08-22; Published: 2009-03-03; Publisher: National Semiconductor; ClassName: Logo; LatestRevisionDate: 2011-10-25; LatestRevisionNote: Added ClassName of Logo.
Logo3 = FCC_disclaimer: SymbolCreator: codlsc; SymbolVersion: 2011-08-22; Published: 2009-03-03; Publisher: Texas Instruments; LatestRevisionDate: 2014-11-20
MH1-MH4 = Mounting Hole (non-standard) No Pad: PCB Mounting Hole, No Pad; Manufacturer: Any; SymbolCreator: a0412235; SymbolVersion: 2013-12-26; ClassName: Mounting Holes; CompType: Mounting Hole; PartNumber: N/A; PackageReference: Mounting Hole; MountType: N/A; Publisher: Texas Instruments; LatestRevisionDate: 2017-06-01
RoHS_Logo1 = Pb-Free: SymbolCreator: a0412235; SymbolVersion: 2011-08-22; Published: 2009-03-03; Publisher: Texas Instruments; LatestRevisionDate: 2016-03-21
SH-J6 SH-J7 SH-J8-1-SH-J8-3 SH-J101-1-SH-J101-7 = SNT-100-BK-G: Shunt, 100mil, Gold plated, Black; Manufacturer: Samtec; Alternate Manufacturer: 3M; Alternate PartNumber: 969102-0000-DA; Value: 1x2; Note: You can "mate" this to a header by matching the designator.  i.e. use SH-J3 for header J3; Green_Lifecycle: Active; Green_REACh: Passed; ClassName: Shunt; CompType: Shunt; PartNumber: SNT-100-BK-G; RoHS: Y; PackageReference: Shunt; MountType: N/A; ComponentLink1Description: Datasheet Link; ComponentLink1URL: http://www.samtec.com/ftppub/pdf/SNT.PDF; Publisher: Texas Instruments; LatestRevisionDate: 2017-05-23; Supplier 1: Digi-Key; Supplier Part Number 1: SNT-100-BK-G-ND; Green_EU RoHS: Passed; Green_EU RoHS-2: Passed
  SH-J6: Assembly: Place J6: 1-2
  SH-J7: Assembly: Place J7: 1-2
  SH-J8-1: Assembly: Place on Pin 2 only
  SH-J8-2: Assembly: Place on Pin 4 only
  SH-J8-3: Assembly: Place on Pin 6 only
  SH-J101-1: Assembly: Place J101: 1-2
  SH-J101-2: Assembly: Place J101: 3-4
  SH-J101-3: Assembly: Place J101: 5-6
  SH-J101-4: Assembly: Place J101: 7-8
  SH-J101-5: Assembly: Place J101: 9-10
  SH-J101-6: Assembly: Place J101: 11-12
  SH-J101-7: Assembly: Place J101: 13-14
TI_Logo_1 = TI_Logo: Texas Instrument Corporate Signature; SymbolCreator: a0412235; SymbolVersion: 2011-08-22; ClassName: Logo; Published: 2009-03-03; Publisher: Texas Instruments; LatestRevisionDate: 2016-03-21
USB1 = CMP-0077983-1: Cable, USB-A to micro USB-B, 0.3 m; Manufacturer: Assman WSW; ComponentLink1URL: http://www.assmann-wsw.com/fileadmin/datasheets/ASS_7091_CA.pdf; Key: AK67421-0.3; CompType: Cable; Supplier 1: Digi-Key; RoHS: Y; Supplier Part Number 1: AE11229-ND; PartNumber: AK67421-0.3; MountType: N/A; ComponentLink1Description: Datasheet Link
ZZ2-ZZ6 = AssemblyNote: SymbolCreator: codlsc; SymbolVersion: 2010-05-18; CompType: AssemblyNote; ClassName: AssemblyNote; Publisher: Texas Instruments; LatestRevisionDate: 2012-06-14; LatestRevisionNote: Initial Version; Alternate Manufacturer: -; Alternate PartNumber: -

## Nets that join several sheets
3.3V: MCU021_V1.0_ezFET_Host (J101.10), MCU021_V1.0_Target_Device (13 pins)
5.0V: MCU021_V1.0_ezFET_Host (J101.12), MCU021_V1.0_Target_Device (5 pins)
EZ_GND: MCU021_V1.0_ezFET_Host (48 pins), MCU021_V1.0_eZFET_DCDC (28 pins)
EZFET_5V: MCU021_V1.0_ezFET_Host (C121.1 C122.1 R110.1 R112.2), MCU021_V1.0_eZFET_DCDC (5 pins)
EZFET_VBUS: MCU021_V1.0_ezFET_Host (16 pins), MCU021_V1.0_eZFET_DCDC (R126.2)
EZFET_VCC: MCU021_V1.0_ezFET_Host (12 pins), MCU021_V1.0_eZFET_DCDC (12 pins)
EZFET_VCCTARGET: MCU021_V1.0_ezFET_Host (J101.9), MCU021_V1.0_eZFET_DCDC (U105.8 U105.9 U105.13 U105.14)
GND: MCU021_V1.0_ezFET_Host (J101.14), MCU021_V1.0_Target_Device (32 pins)
EZFET_A_VBUS: MCU021_V1.0_ezFET_Host (U100.1), MCU021_V1.0_eZFET_DCDC (C137.1 R126.1 R130.2)
EZFET_A_VCCOUT2ADC: MCU021_V1.0_ezFET_Host (U100.2), MCU021_V1.0_eZFET_DCDC (C135.2 C139.1 R128.1 R132.2)
EZFET_DCDCIO0: MCU021_V1.0_ezFET_Host (U100.5), MCU021_V1.0_eZFET_DCDC (U104.4)
EZFET_DCDCIO1: MCU021_V1.0_ezFET_Host (U100.6), MCU021_V1.0_eZFET_DCDC (U104.5)
EZFET_DCDCPULSE: MCU021_V1.0_ezFET_Host (U100.28), MCU021_V1.0_eZFET_DCDC (R121.1 U104.3)
EZFET_DCDCRST: MCU021_V1.0_ezFET_Host (U100.7), MCU021_V1.0_eZFET_DCDC (U104.9)
EZFET_DCDCTEST: MCU021_V1.0_ezFET_Host (U100.8), MCU021_V1.0_eZFET_DCDC (U104.10)
EZFET_SCL: MCU021_V1.0_ezFET_Host (U100.35), MCU021_V1.0_eZFET_DCDC (R119.1 U104.7)
EZFET_SDA: MCU021_V1.0_ezFET_Host (U100.34), MCU021_V1.0_eZFET_DCDC (R118.1 U104.8)
EZFET_VCCEN1: MCU021_V1.0_ezFET_Host (U100.26), MCU021_V1.0_eZFET_DCDC (R136.2 U105.5)
EZFET_VCCEN2: MCU021_V1.0_ezFET_Host (U100.27), MCU021_V1.0_eZFET_DCDC (R135.2 U105.3)
P1.1_UART_RX: MCU021_V1.0_ezFET_Host (J101.5), MCU021_V1.0_Target_Device (J1.3 XU1.3)
P1.2_UART_TX: MCU021_V1.0_ezFET_Host (J101.8), MCU021_V1.0_Target_Device (J1.4 XU1.4)
RST/SBWTDIO: MCU021_V1.0_ezFET_Host (J101.4), MCU021_V1.0_Target_Device (6 pins)
TST/SBWTCK: MCU021_V1.0_ezFET_Host (J101.2), MCU021_V1.0_Target_Device (J2.17 XU1.17)

## Assembly variants
001: not fitted C1 C5 C6 C7 C8 C9 C12 C14 C106 C107 C133 C138 C139 FID1 FID2 FID3 J100 R1 R2 R5 R7 R112 R122